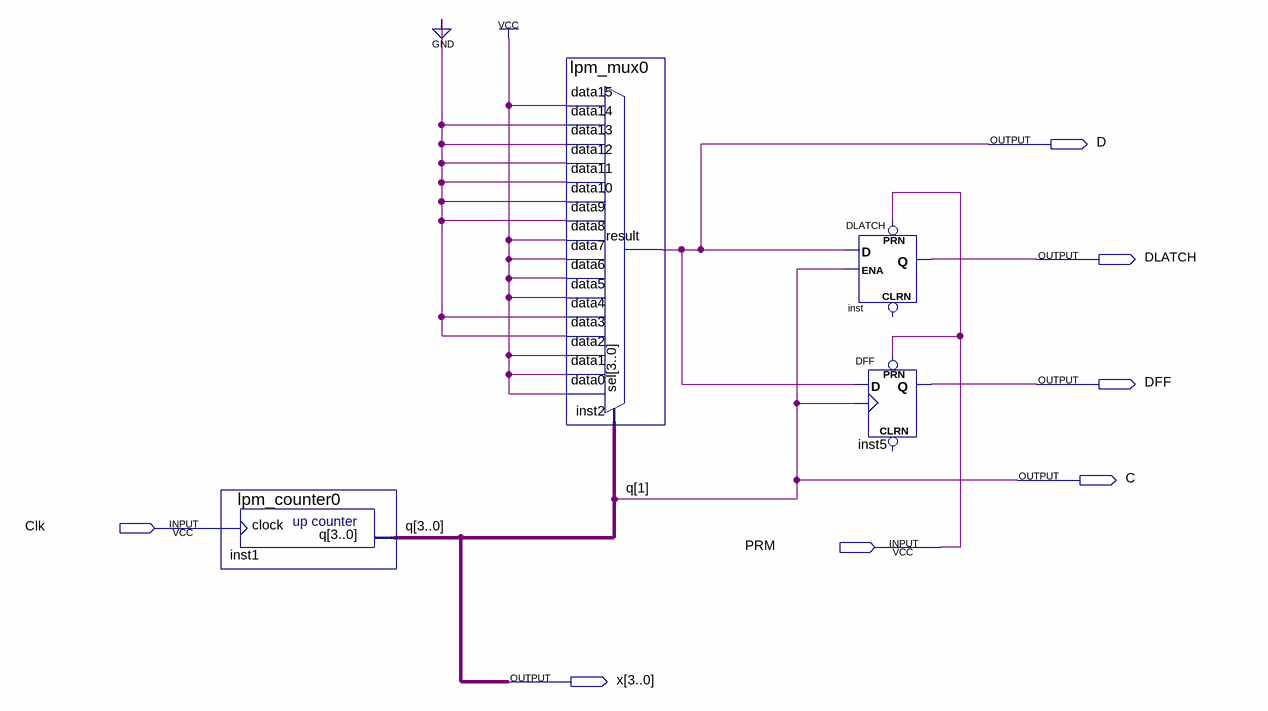
[diagram p0: schematic sheet]
// Quartus schematic D.bdf as structural Verilog: 4 symbols, 7 pins
module D (
  input  Clk,
  input  PRM,
  output D,
  output DLATCH,
  output DFF,
  output C,
  output [3:0] x
);

  lpm_counter0 inst1 (.clock(Clk), .q({x[3:2], C, x[0]}));
  lpm_mux0 inst2 (
    .data15(1'b1), .data14(1'b0), .data13(1'b0), .data12(1'b0), .data11(1'b0), .data10(1'b0), .data9(1'b0),
    .data8(1'b1), .data7(1'b1), .data6(1'b1), .data5(1'b1), .data4(1'b0), .data3(1'b0), .data2(1'b1),
    .data1(1'b1), .data0(1'b1), .sel({x[3:2], C, x[0]}), .result(D));
  DLATCH inst (.D(D), .ENA(C), .PRN(PRM), .Q(DLATCH));  // open: CLRN
  DFF inst5 (.CLK(C), .D(D), .PRN(PRM), .Q(DFF));  // open: CLRN

  assign x[1] = C;

  // Other names for the same wires on the sheet: q[3:0] = {x[3:2], C, x[0]}
endmodule
